# Altium schematic sheet Sheet1.SchDoc
size A4
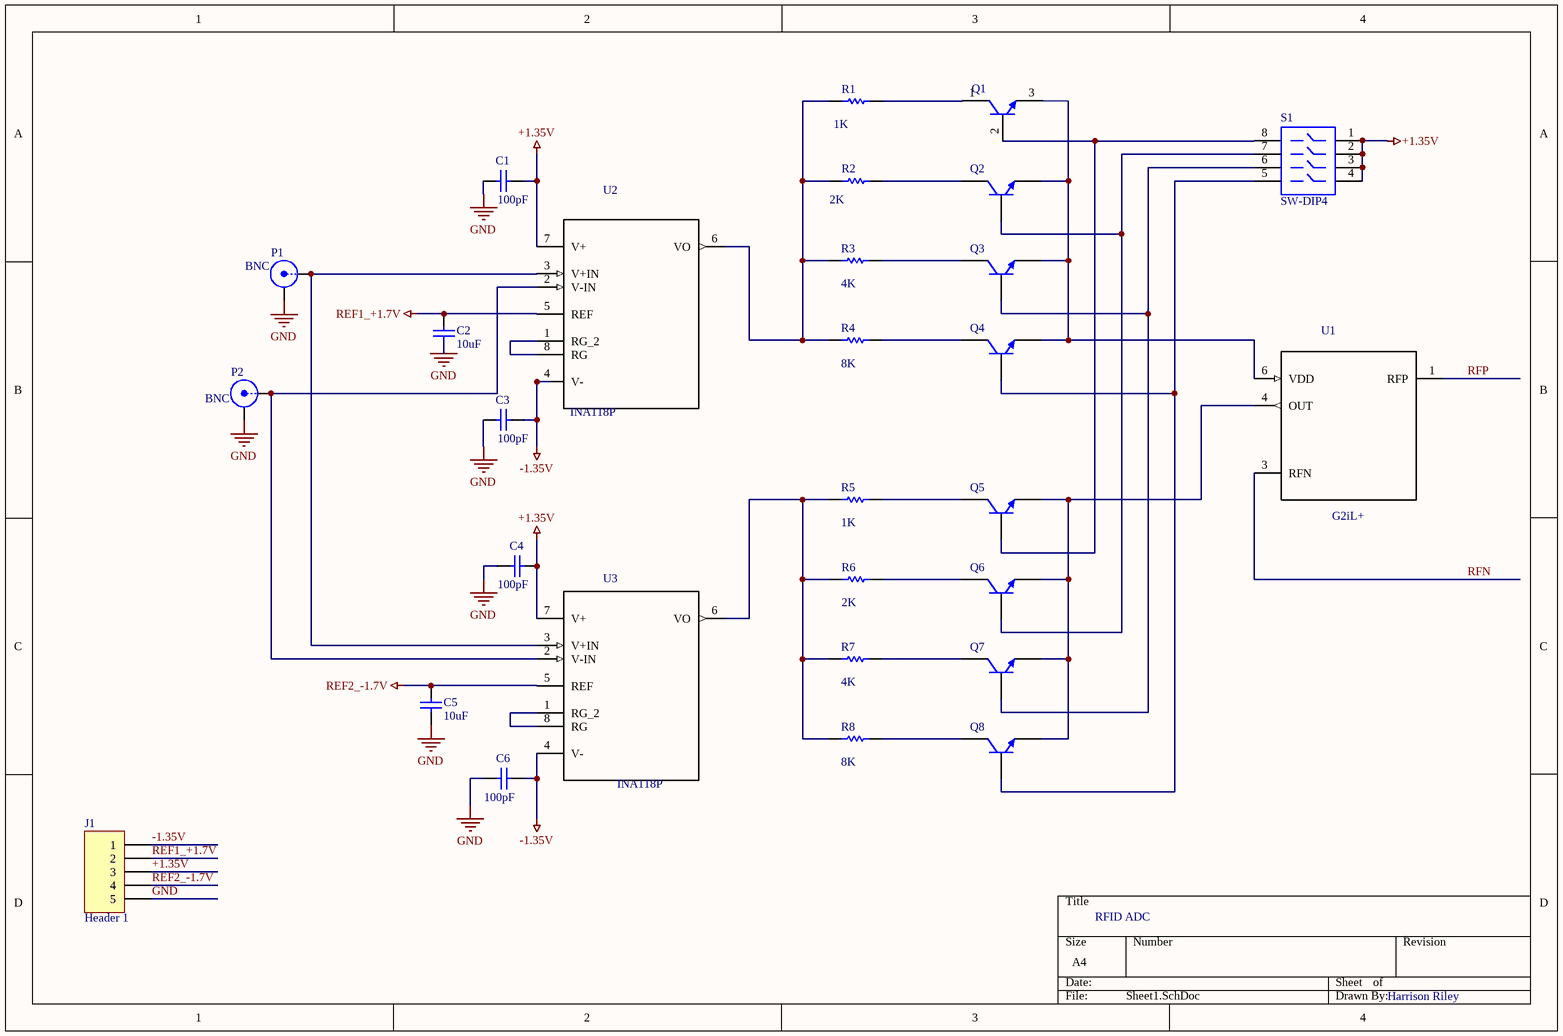
[diagram p0: Sheet1.SchDoc]

## Parts
C1  value 100pF  [RAD-0.3]  (hidden comment: Cap)
C2  value 10uF  [RAD-0.3]  (hidden comment: Cap)
C3  value 100pF  [RAD-0.3]  (hidden comment: Cap)
C4  value 100pF  [RAD-0.3]  (hidden comment: Cap)
C5  value 10uF  [RAD-0.3]  (hidden comment: Cap)
C6  value 100pF  [RAD-0.3]  (hidden comment: Cap)
J1  Header 1  [HDR1X5]
P1  BNC  [BNC_RA CON]
P2  BNC  [BNC_RA CON]
Q1  QNPN  [SOT-23B_L]  (value not drawn)
Q2  QNPN  [SOT-23B_L]  (value not drawn)
Q3  QNPN  [SOT-23B_L]  (value not drawn)
Q4  QNPN  [SOT-23B_L]  (value not drawn)
Q5  QNPN  [SOT-23B_L]  (value not drawn)
Q6  QNPN  [SOT-23B_L]  (value not drawn)
Q7  QNPN  [SOT-23B_L]  (value not drawn)
Q8  QNPN  [SOT-23B_L]  (value not drawn)
R1  value 1K  [AXIAL-0.3]  (hidden comment: Res1)
R2  value 2K  [AXIAL-0.3]  (hidden comment: Res1)
R3  value 4K  [AXIAL-0.3]  (hidden comment: Res1)
R4  value 8K  [AXIAL-0.3]  (hidden comment: Res1)
R5  value 1K  [AXIAL-0.3]  (hidden comment: Res1)
R6  value 2K  [AXIAL-0.3]  (hidden comment: Res1)
R7  value 4K  [AXIAL-0.3]  (hidden comment: Res1)
R8  value 8K  [AXIAL-0.3]  (hidden comment: Res1)
S1  SW-DIP4  [DIP-8]
U1  G2iL+  [*SON50P100X145X50-6N]
U2  INA118P  [*DIP254P762X508-8]
U3  INA118P  [*DIP254P762X508-8]

## Nets
+1.35V: C1.2 C4.2 J1.3 S1.1 S1.2 S1.3 S1.4 U2.7(V+) U3.7(V+)
-1.35V: C3.2 C6.2 J1.1 U2.4(V-) U3.4(V-)
GND: C1.1 C2.1 C3.1 C4.1 C5.1 C6.1 J1.5 P1.2(Y) P2.2(Y)
REF1_+1.7V: C2.2 J1.2 U2.5(REF)
REF2_-1.7V: C5.2 J1.4 U3.5(REF)
RFN: U1.3(RFN)
RFP: U1.1(RFP)
NetP1_1: P1.1(X) U2.3(V+IN) U3.3(V+IN)
NetP2_1: P2.1(X) U2.2(V-IN) U3.2(V-IN)
NetQ1_1: Q1.1(C) R1.2
NetQ1_2: Q1.2(B) Q5.2(B) S1.8
NetQ1_3: Q1.3(E) Q2.3(E) Q3.3(E) Q4.3(E) U1.6(VDD)
NetQ2_1: Q2.1(C) R2.2
NetQ2_2: Q2.2(B) Q6.2(B) S1.7
NetQ3_1: Q3.1(C) R3.2
NetQ3_2: Q3.2(B) Q7.2(B) S1.6
NetQ4_1: Q4.1(C) R4.2
NetQ4_2: Q4.2(B) Q8.2(B) S1.5
NetQ5_1: Q5.1(C) R5.2
NetQ5_3: Q5.3(E) Q6.3(E) Q7.3(E) Q8.3(E) U1.4(OUT)
NetQ6_1: Q6.1(C) R6.2
NetQ7_1: Q7.1(C) R7.2
NetQ8_1: Q8.1(C) R8.2
NetR1_1: R1.1 R2.1 R3.1 R4.1 U2.6(VO)
NetR5_1: R5.1 R6.1 R7.1 R8.1 U3.6(VO)
NetU2_1: U2.1(RG_2) U2.8(RG)
NetU3_1: U3.1(RG_2) U3.8(RG)

Not connected (* = marked no-connect by the designer): U1 2(N.C) 5(N.C_2)

## Notes on the sheet
- RFID ADC
- Harrison Riley

## Library data of the parts
C1-C6 = Cap: Capacitor; Published: 8-Jun-2000; LatestRevisionDate: 17-Jul-2002; LatestRevisionNote: Re-released for DXP Platform.; PackageReference: RAD-0.3; Publisher: Altium Limited; PackageDescription: Radial Cap, Thru-Hole; 2 Leads; 0.3 in Pin Spacing
J1 = Header 5: Header, 5-Pin; LatestRevisionDate: 17-Jul-2002; LatestRevisionNote: Re-released for DXP Platform.; Publisher: Altium Limited
P1 P2 = BNC: BNC Elbow Connector; LatestRevisionDate: 17-Jul-2002; LatestRevisionNote: Re-released for DXP Platform.; Publisher: Altium Limited
Q1-Q8 = QNPN: NPN Bipolar Transistor; Published: 8-Jun-2000; LatestRevisionDate: 29-May-2009; LatestRevisionNote: IPC-7351 Footprint Added.; PackageVersion: Aug-1999; PackageReference: SOT-23B; Publisher: Altium Limited; PackageDescription: 3-Pin SOT-23 Package 0.95 mm Pitch, 2.4 mm Lead Span
R1-R8 = Res1: Resistor; Published: 8-Jun-2000; LatestRevisionDate: 17-Jul-2002; LatestRevisionNote: Re-released for DXP Platform.; PackageReference: AXIAL-0.3; Publisher: Altium Limited; PackageDescription: Axial Device, Thru-Hole; 2 Leads; 0.3 in Pin Spacing
S1 = SW-DIP4: DIP Switch; Published: 24-Mar-1999; LatestRevisionDate: 17-Jul-2002; LatestRevisionNote: Re-released for DXP Platform.; PackageReference: DIP-8; Publisher: Altium Limited
U1 = LD6806F/29H: Ldo, 2.9v, Sot886; MF: Nexperia; MP: LD6806F/29H; Price: None; Package: None; Availability: Unavailable; SnapEDA_Link: https://www.snapeda.com/parts/LD6806F/29H/Nexperia/view-part/?ref=snap; Value: *
U2 U3 = INA118P: / SP Amp INSTR Amp Single Â±18V 8-Pin PDIP SP Amp INSTR Amp Single Â±18V 8-Pin PDIP SP Amp INSTR Amp Single Â±18V 8-Pin... /; MF: Texas Instruments; Availability: Unavailable; Price: None; Package: PDIP-8 Burr Brown; SnapEDA_Link: https://www.snapeda.com/parts/INA118P/Texas%20Instruments/view-part/?ref=snap; MP: INA118P; Value: *